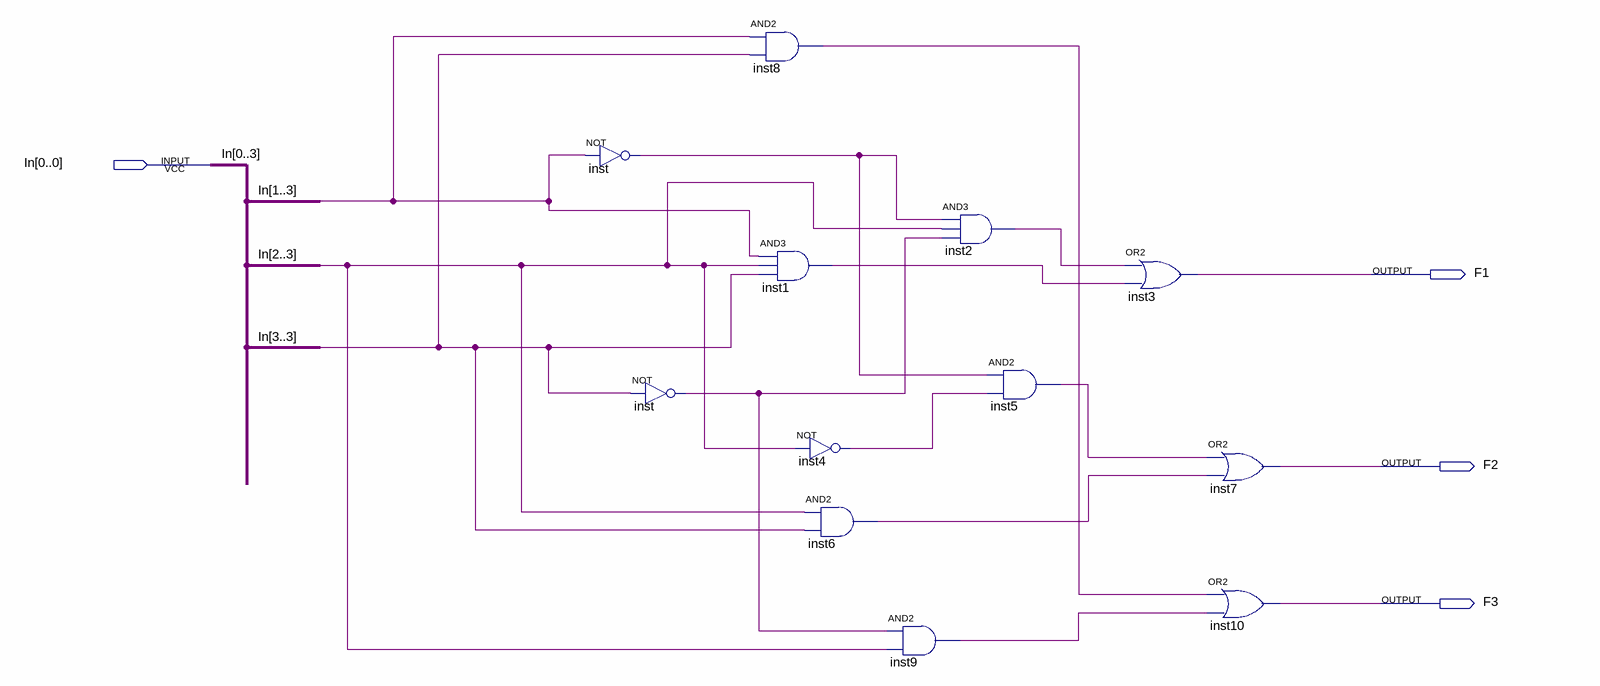
[diagram p0: schematic sheet]
// Quartus schematic TH2.bdf as structural Verilog: 12 symbols, 4 pins
module TH2 (
  input  [3:0] In,
  output F1,
  output F2,
  output F3
);

  wire inst1_out, inst2_out, inst4_out, inst5_out, inst6_out, inst8_out, inst9_out, inst_out, inst_out_2,
       undriven, undriven_2;

  not inst (inst_out, undriven);
  not inst_dup2 (inst_out_2, In[3]);
  and inst8 (inst8_out, undriven, In[3]);
  and inst1 (inst1_out, undriven, undriven_2, In[3]);
  not inst4 (inst4_out, undriven_2);
  and inst6 (inst6_out, undriven_2, In[3]);
  and inst9 (inst9_out, inst_out_2, undriven_2);
  and inst2 (inst2_out, inst_out, undriven_2, inst_out_2);
  and inst5 (inst5_out, inst_out, inst4_out);
  or inst3 (F1, inst2_out, inst1_out);
  or inst7 (F2, inst5_out, inst6_out);
  or inst10 (F3, inst8_out, inst9_out);
endmodule
